# Altium project EE_3102.PrjPcb
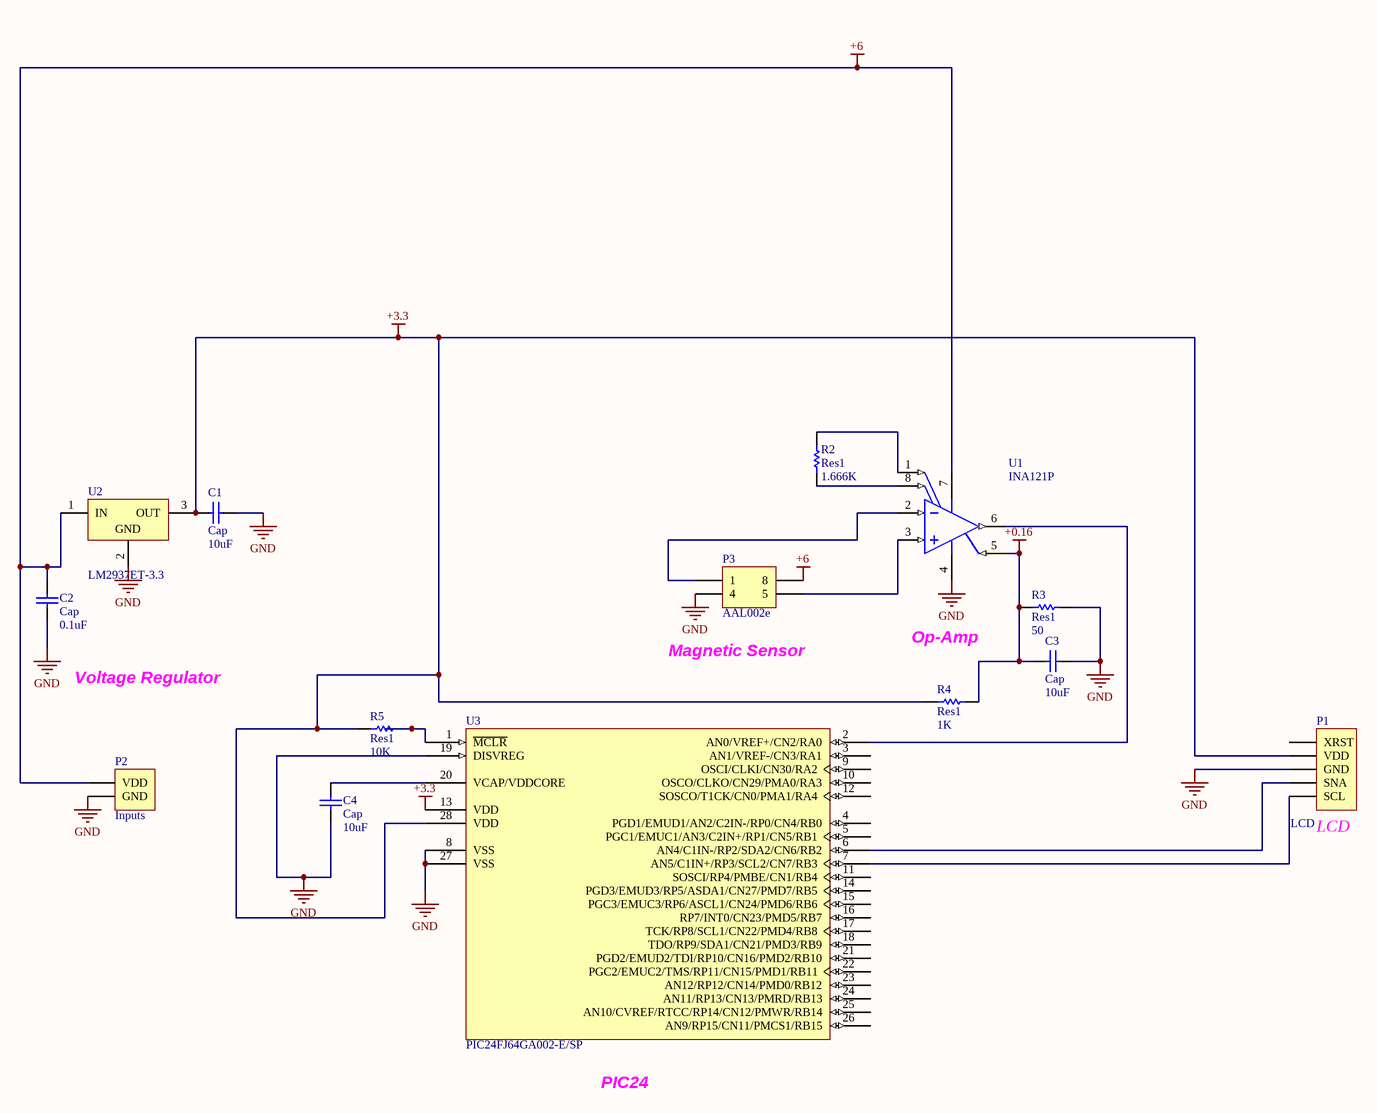
[diagram p0: EE_3102.SchDoc]
1 sheet, 14 parts. Net scope: global (net labels, ports and power ports of the same name join across sheets).
Board file: EE_3102.PcbDoc

## Sheet EE_3102.SchDoc
size B; SheetNumber: 1; SheetTotal: 1

### Parts
C1  Cap  value 10uF  [RAD-0.3]
C2  Cap  value 0.1uF  [RAD-0.3]
C3  Cap  value 10uF  [RAD-0.3]
C4  Cap  value 10uF  [RAD-0.3]
P1  LCD  [HDR1X5]
P2  Inputs  [HDR1X2]
P3  AAL002e  [HDR2X2]
R2  Res1  value 1.666K  [AXIAL-0.3]
R3  Res1  value 50  [AXIAL-0.3]
R4  Res1  value 1K  [AXIAL-0.3]
R5  Res1  value 10K  [AXIAL-0.3]
U1  INA121P  [P0008A]
U2  LM2937ET-3.3  [NDE0003A]
U3  PIC24FJ64GA002-E/SP  [SPDIP300-SP28]

### Nets
+0.16: C3.1 R3.2 R4.1 U1.5(REF)
+3.3: C1.2 P1.2(VDD) R4.2 R5.1 U2.3(OUT) U3.13(VDD) U3.28(VDD)
+6: C2.2 P2.1(VDD) P3.2(8) U1.7(V+) U2.1(IN)
GND: C1.1 C2.1 C3.2 C4.1 P1.3(GND) P2.2(GND) P3.3(4) R3.1 U1.4(V-) U2.2(GND) U3.8(VSS) U3.19(DISVREG) U3.27(VSS)
NetC4_2: C4.2 U3.20(VCAP/VDDCORE)
NetP1_4: P1.4(SNA) U3.6(AN4/C1IN-/RP2/SDA2/CN6/RB2)
NetP1_5: P1.5(SCL) U3.7(AN5/C1IN+/RP3/SCL2/CN7/RB3)
NetP3_1: P3.1 U1.2(VIN-)
NetP3_4: P3.4(5) U1.3(VIN+)
NetR2_1: R2.1 U1.8(RG)
NetR2_2: R2.2 U1.1(RG)
NetR5_2: R5.2 U3.1(~{MCLR})
NetU1_6: U1.6(VO) U3.2(AN0/VREF+/CN2/RA0)

Not connected (* = marked no-connect by the designer): P1 1(XRST); U3 3(AN1/VREF-/CN3/RA1) 4(PGD1/EMUD1/AN2/C2IN-/RP0/CN4/RB0) 5(PGC1/EMUC1/AN3/C2IN+/RP1/CN5/RB1) 9(OSCI/CLKI/CN30/RA2) 10(OSCO/CLKO/CN29/PMA0/RA3) 11(SOSCI/RP4/PMBE/CN1/RB4) 12(SOSCO/T1CK/CN0/PMA1/RA4) 14(PGD3/EMUD3/RP5/ASDA1/CN27/PMD7/RB5) 15(PGC3/EMUC3/RP6/ASCL1/CN24/PMD6/RB6) 16(RP7/INT0/CN23/PMD5/RB7) 17(TCK/RP8/SCL1/CN22/PMD4/RB8) 18(TDO/RP9/SDA1/CN21/PMD3/RB9) 21(PGD2/EMUD2/TDI/RP10/CN16/PMD2/RB10) 22(PGC2/EMUC2/TMS/RP11/CN15/PMD1/RB11) 23(AN12/RP12/CN14/PMD0/RB12) 24(AN11/RP13/CN13/PMRD/RB13) 25(AN10/CVREF/RTCC/RP14/CN12/PMWR/RB14) 26(AN9/RP15/CN11/PMCS1/RB15)

### Notes on the sheet
- Voltage Regulator
- (near P3) Magnetic Sensor
- Op-Amp
- (near P1) LCD
- (near U3) PIC24

### Library data of the parts
C1-C4 = Cap: Capacitor; Published: 8-Jun-2000; LatestRevisionDate: 17-Jul-2002; LatestRevisionNote: Re-released for DXP Platform.; PackageReference: RAD-0.3; Publisher: Altium Limited; PackageDescription: Radial Cap, Thru-Hole; 2 Leads; 0.3 in Pin Spacing
P1 = Header 5: Header, 5-Pin; LatestRevisionDate: 17-Jul-2002; LatestRevisionNote: Re-released for DXP Platform.; Publisher: Altium Limited
P2 = Header 2: Header, 2-Pin; LatestRevisionDate: 17-Jul-2002; LatestRevisionNote: Re-released for DXP Platform.; Publisher: Altium Limited
P3 = Header 2X2: Header, 2-Pin, Dual row; pin to pad: 1>2 2>1; LatestRevisionDate: 17-Jul-2002; LatestRevisionNote: Re-released for DXP Platform.; Publisher: Altium Limited
R2-R5 = Res1: Resistor; Published: 8-Jun-2000; LatestRevisionDate: 17-Jul-2002; LatestRevisionNote: Re-released for DXP Platform.; PackageReference: AXIAL-0.3; Publisher: Altium Limited; PackageDescription: Axial Device, Thru-Hole; 2 Leads; 0.3 in Pin Spacing
U1 = CMP-0992-00127-2: FET-Input, Low Power Instrumentation Amplifier, -40 to 85 degC, 8-pin DIP (P8), Green (RoHS & no Sb/Br); Manufacturer: Texas Instruments; Input Bias Current (+/-)(Max)(nA): 0.05; SubFamily: Dual Supply; Input Offset Drift (+/-)(Max)(uV/Degrees Celsius): 5; Input Offset (+/-)(Max)(uV): 500; Quiescent Current (+/-)(Typ)(mA): 0.45; Non-Linearity (+/-)(Max)(%): 0.005; Number of Channels: 1; Noise at 1kHz(Typ)(nV/rt(Hz)): 20; CMRR(Min)(dB): 96; Output Offset Drift (+/-)(Max)(uV/Degrees Celsius): 20/G; Vs(Min)(V): 4.5; Gain(V/V): 1 to 10000; Output Offset (+/-)(Max)(uV): 500/G; Vs(Max)(V): 36; ComponentLink3URL: http://www.ti.com/litv/pdf/mpdi001b; ComponentLink3Description: Package Specification; Mounting Technology: Through Hole; ComponentLink2Description: Datasheet; PackageReference: P0008A; Code_JEDEC: MS-001; Eco-Plan: Green (RoHS & no Sb/Br); ComponentLink1URL: http://www.ti.com/; ComponentLink2URL: http://www.ti.com/general/docs/lit/getliterature.tsp?genericPartNumber=INA121&fileType=pdf; PartNumber: INA121P; ComponentLink1Description: Manufacturer URL; PackageDescription: 8-Pin Plastic In-Line, Body 9.59 x 6.35 mm, Pitch 2.54 mm; DatasheetVersion: SBOS078; PackageVersion: 4040082/E, 04/2010
U2 = CMP-0062-02522-3: 500 mA Low Dropout Regulator, 3-pin TO-220; Manufacturer: Texas Instruments; PackageTopMarking: NSUZXYTTE#*LM2937ET*-3.3; PowerWise: N; CompType: LDO IC; ComponentLink1Description: Datasheet URL; PackageReference: NDE0003A; PackageDescription: TO-220, Molded, 3 Lead, Straight; PinCount: 3; ComponentLink1URL: http://www.ti.com/general/docs/lit/getliterature.tsp?genericPartNumber=LM2937-3.3&fileType=pdf; RoHS: N
U3 = CMP-0046-00005-2: General Purpose 16-Bit Flash Microcontroller, 64KB Flash, 8KB SRAM, 28-Pin SPDIP, Extended Temperature; ComponentLink2URL: http://www.microchip.com/stellent/groups/techpub_sg/documents/packagingspec/en012702.pdf; RevisionNote: Component URLs added.; PackageVersion: revBB, Aug-2009; ComponentLink2Description: Packaging Specification; PackageReference: SPDIP300-SP28; ComponentLink3URL: http://www.microchip.com/; ComponentLink1Description: Datasheet; PackageDescription: 28-Lead Skinny Plastic Dual In-Line (SP) - 300 mil Body [SPDIP]; DatasheetVersion: revD, Feb-2010; ComponentLink3Description: Microchip.com Home; ComponentLink1URL: http://ww1.microchip.com/downloads/en/DeviceDoc/39881D.pdf